# Altium project Mixer_8ch_USB_Jack.PrjPcb
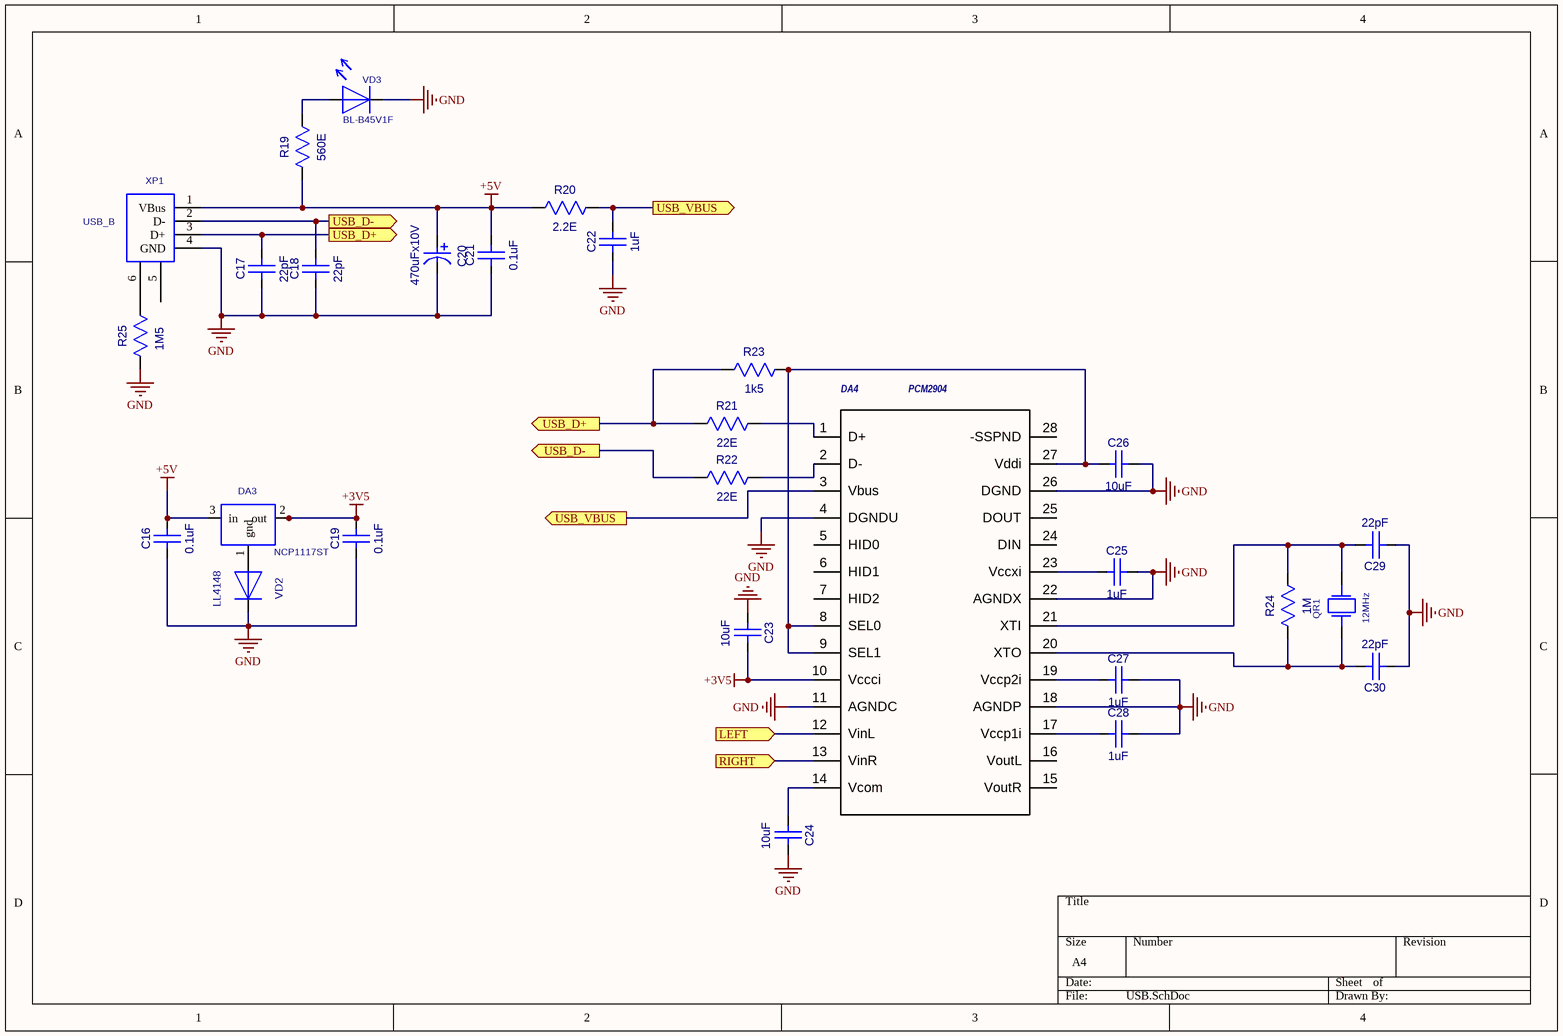
[diagram p0: USB.SchDoc]
2 sheets, 93 parts. Net scope: flat (ports and power ports of the same name join across sheets).
Board file: Mixer_8_USB_jack.PcbDoc
Sheets:
  USB.SchDoc
  Analog_out.SchDoc

## Sheet USB.SchDoc
size A4

### Parts
C16  0.1uF  [CC0603-3M]
C17  22pF  [CC0603-3M]
C18  22pF  [CC0603-3M]
C19  0.1uF  [CC0603-3M]
C20  470uFx10V  [CC8X3.5]
C21  0.1uF  [CC0603-3M]
C22  1uF  [CC0603-3M]
C23  10uF  [CC0805-MIDI-2M1]
C24  10uF  [CC0805-MIDI-2M1]
C25  1uF  [CC0603-3M]
C26  10uF  [CC0805-MIDI-2M1]
C27  1uF  [CC0603-3M]
C28  1uF  [CC0603-3M]
C29  22pF  [CC0603-3M]
C30  22pF  [CC0603-3M]
DA3  NCP1117ST  [SOT-223]
DA4  PCM2904  [TSSOP28]
QR1  12MHz  [HC-49]
R19  560E  [RC0603-3M]
R20  2.2E  [RC0805_IPC_NOM]
R21  22E  [RC0603-3M]
R22  22E  [RC0603-3M]
R23  1k5  [RC0603-3M]
R24  1M  [RC0603-3M]
R25  1M5  [RC1206-2M]
VD2  LL4148  [SOD-80]
VD3  BL-B45V1F  [LED3]
XP1  USB_B  [USB-B]

### Ports
LEFT (in), RIGHT (in), USB_D+ (out), USB_D- (out), USB_VBUS (out)

### Nets
+3V5: C19.2(B) C23.2(B) DA3.2(out) DA3.4 DA4.10(Vccci)
+5V: C16.2(B) C20.1 C21.2(B) DA3.3(in) R19.1(A) R20.1(A) XP1.1(VBus)
GND: C16.1(A) C17.1(A) C18.1(A) C19.1(A) C20.2 C21.1(A) C22.1(A) C23.1(A) C24.2(B) C25.2(B) C26.2(B) C27.2(B) C28.2(B) C29.1(A) C30.1(A) DA4.4(DGNDU) DA4.11(AGNDC) DA4.18(AGNDP) DA4.22(AGNDX) DA4.26(DGND) R25.1(A) VD2.2(+) VD3.1 XP1.4(GND)
NetC14_2: DA4.12(VinL) ; port LEFT
NetC15_2: DA4.13(VinR) ; port RIGHT
NetC17_2: C17.2(B) R21.1(A) R23.1(A) XP1.3(D+) ; port USB_D+
NetC18_2: C18.2(B) R22.1(A) XP1.2(D-) ; port USB_D-
NetC22_2: C22.2(B) DA4.3(Vbus) R20.2(B) ; port USB_VBUS
NetC24_1: C24.1(A) DA4.14(Vcom)
NetC25_1: C25.1(A) DA4.23(Vccxi)
NetC26_1: C26.1(A) DA4.8(SEL0) DA4.9(SEL1) DA4.27(Vddi) R23.2(B)
NetC27_1: C27.1(A) DA4.19(Vccp2i)
NetC28_1: C28.1(A) DA4.17(Vccp1i)
NetC29_2: C29.2(B) DA4.21(XTI) QR1.2 R24.2(B)
NetC30_2: C30.2(B) DA4.20(XTO) QR1.1 R24.1(A)
NetDA3_1: DA3.1(gnd) VD2.1(-)
NetDA4_1: DA4.1(D+) R21.2(B)
NetDA4_2: DA4.2(D-) R22.2(B)
NetR19_2: R19.2(B) VD3.2
NetR25_2: R25.2(B) XP1.6

Not connected (* = marked no-connect by the designer): DA4 5(HID0) 6(HID1) 7(HID2) 15(VoutR) 16(VoutL) 24(DIN) 25(DOUT) 28(-SSPND); XP1 5

### Library data of the parts
C16-C19 C21 C22 C25 C27-C30 = CC0603
  C16 C19 C21: Value: 0.1uF
  C17 C18 C29 C30: Value: 22pF
  C22 C25 C27 C28: Value: 1uF
C20 = CAP0.35: Value: 470uFx10V
C23 C24 C26 = CC0805: Value: 10uF
QR1 = LP-3.5: Value: 12MHz
R19 R21-R24 = RC0603
  R19: Value: 560E
  R21 R22: Value: 22E
  R23: Value: 1k5
  R24: Value: 1M
R20 = RC0805: Value: 2.2E
R25 = RC1206: Value: 1M5
VD3 = LED_3: Value: BL-B45V1F
DA3 = NCP1117ST: Value: *
DA4 = PCM2904: Value: *
VD2 = LL4148: Value: *
XP1 = USB_B: Value: *

## Sheet Analog_out.SchDoc
size A4
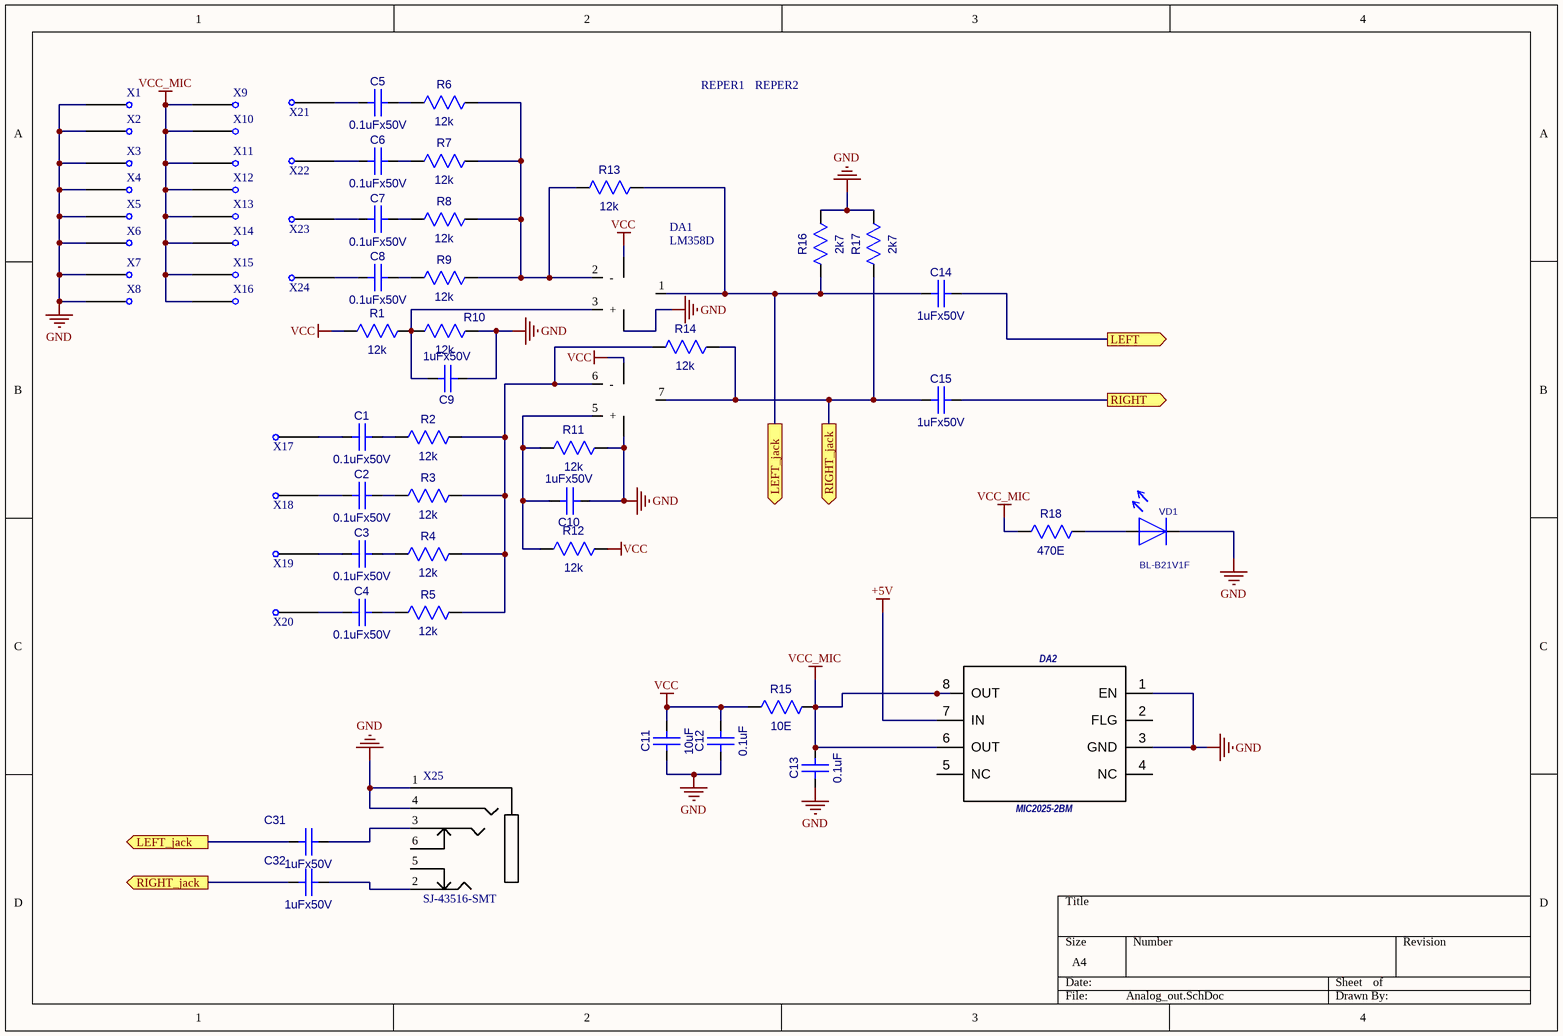
[diagram p1: Analog_out.SchDoc]

### Parts
C1  0.1uFx50V  [CC0603-3M]
C2  0.1uFx50V  [CC0603-3M]
C3  0.1uFx50V  [CC0603-3M]
C4  0.1uFx50V  [CC0603-3M]
C5  0.1uFx50V  [CC0603-3M]
C6  0.1uFx50V  [CC0603-3M]
C7  0.1uFx50V  [CC0603-3M]
C8  0.1uFx50V  [CC0603-3M]
C9  1uFx50V  [CC0603-3M]
C10  1uFx50V  [CC0603-3M]
C11  10uF  [CC0805-MIDI-2M1]
C12  0.1uF  [CC0603-3M]
C13  0.1uF  [CC0603-3M]
C14  1uFx50V  [CC0603-3M]
C15  1uFx50V  [CC0603-3M]
C31  1uFx50V  [CC0603-3M]
C32  1uFx50V  [CC0603-3M]
DA1  LM358D  [SO-8]
DA2  MIC2025-2BM  [SO-8]
R1  12k  [RC0603-3M]
R2  12k  [RC0603-3M]
R3  12k  [RC0603-3M]
R4  12k  [RC0603-3M]
R5  12k  [RC0603-3M]
R6  12k  [RC0603-3M]
R7  12k  [RC0603-3M]
R8  12k  [RC0603-3M]
R9  12k  [RC0603-3M]
R10  12k  [RC0603-3M]
R11  12k  [RC0603-3M]
R12  12k  [RC0603-3M]
R13  12k  [RC0603-3M]
R14  12k  [RC0603-3M]
R15  10E  [RC0805_IPC_NOM]
R16  2k7  [RC0603-3M]
R17  2k7  [RC0603-3M]
R18  470E  [RC0603-3M]
REPER1  REPER1.2  [REPER1.2]  (value not drawn)
REPER2  REPER1.2  [REPER1.2]  (value not drawn)
VD1  BL-B21V1F  [LED3]
X1  PIN_1mm  [PIN_1mm]  (value not drawn)
X2  PIN_1mm  [PIN_1mm]  (value not drawn)
X3  PIN_1mm  [PIN_1mm]  (value not drawn)
X4  PIN_1mm  [PIN_1mm]  (value not drawn)
X5  PIN_1mm  [PIN_1mm]  (value not drawn)
X6  PIN_1mm  [PIN_1mm]  (value not drawn)
X7  PIN_1mm  [PIN_1mm]  (value not drawn)
X8  PIN_1mm  [PIN_1mm]  (value not drawn)
X9  PIN_1mm  [PIN_1mm]  (value not drawn)
X10  PIN_1mm  [PIN_1mm]  (value not drawn)
X11  PIN_1mm  [PIN_1mm]  (value not drawn)
X12  PIN_1mm  [PIN_1mm]  (value not drawn)
X13  PIN_1mm  [PIN_1mm]  (value not drawn)
X14  PIN_1mm  [PIN_1mm]  (value not drawn)
X15  PIN_1mm  [PIN_1mm]  (value not drawn)
X16  PIN_1mm  [PIN_1mm]  (value not drawn)
X17  PIN_1mm  [PIN_1mm]  (value not drawn)
X18  PIN_1mm  [PIN_1mm]  (value not drawn)
X19  PIN_1mm  [PIN_1mm]  (value not drawn)
X20  PIN_1mm  [PIN_1mm]  (value not drawn)
X21  PIN_1mm  [PIN_1mm]  (value not drawn)
X22  PIN_1mm  [PIN_1mm]  (value not drawn)
X23  PIN_1mm  [PIN_1mm]  (value not drawn)
X24  PIN_1mm  [PIN_1mm]  (value not drawn)
X25  SJ-43516-SMT  [SJ-43516-SMT]

### Ports
LEFT (out), LEFT_jack (out), RIGHT (out), RIGHT_jack (out)

### Nets
+5V: DA2.7(IN)
GND: C9.1(A) C10.1(A) C11.1(A) C12.1(A) C13.1(A) DA1.4(Vss) DA2.1(EN) DA2.3(GND) R10.2(B) R11.2(B) R16.2(B) R17.2(B) VD1.1 X1.1 X2.1 X3.1 X4.1 X5.1 X6.1 X7.1 X8.1 X25.1 X25.4
VCC: C11.2(B) C12.2(B) DA1.8(Vdd) R1.1(A) R12.2(B) R15.1(A)
VCC_MIC: C13.2(B) DA2.6(OUT) DA2.8(OUT) R15.2(B) R18.1(A) X9.1 X10.1 X11.1 X12.1 X13.1 X14.1 X15.1 X16.1
NetC1_1: C1.1(A) X17.1
NetC1_2: C1.2(B) R2.1(A)
NetC2_1: C2.1(A) X18.1
NetC2_2: C2.2(B) R3.1(A)
NetC3_1: C3.1(A) X19.1
NetC3_2: C3.2(B) R4.1(A)
NetC4_1: C4.1(A) X20.1
NetC4_2: C4.2(B) R5.1(A)
NetC5_1: C5.1(A) X21.1
NetC5_2: C5.2(B) R6.1(A)
NetC6_1: C6.1(A) X22.1
NetC6_2: C6.2(B) R7.1(A)
NetC7_1: C7.1(A) X23.1
NetC7_2: C7.2(B) R8.1(A)
NetC8_1: C8.1(A) X24.1
NetC8_2: C8.2(B) R9.1(A)
NetC9_2: C9.2(B) DA1.3(+) R1.2(B) R10.1(A)
NetC10_2: C10.2(B) DA1.5(+) R11.1(A) R12.1(A)
NetC14_1: C14.1(A) C31.1(A) DA1.1(Out1) R13.2(B) R16.1(A) ; port LEFT_jack
NetC14_2: C14.2(B) ; port LEFT
NetC15_1: C15.1(A) C32.1(A) DA1.7(Out2) R14.2(B) R17.1(A) ; port RIGHT_jack
NetC15_2: C15.2(B) ; port RIGHT
NetC31_2: C31.2(B) X25.3
NetC32_2: C32.2(B) X25.2
NetDA1_2: DA1.2(-) R6.2(B) R7.2(B) R8.2(B) R9.2(B) R13.1(A)
NetDA1_6: DA1.6(-) R2.2(B) R3.2(B) R4.2(B) R5.2(B) R14.1(A)
NetR18_2: R18.2(B) VD1.2

Not connected (* = marked no-connect by the designer): DA2 2(FLG) 4(NC) 5(NC); REPER1 1; REPER2 1; X25 5 6

### Library data of the parts
C1-C10 C14 C15 C31 C32 = CC0603: CC0603 X7R
  C1-C8: Value: 0.1uFx50V
  C9 C10 C14 C15 C31 C32: Value: 1uFx50V
C11 = CC0805: Value: 10uF
C12 C13 = CC0603: Value: 0.1uF
R1-R14 R16-R18 = RC0603
  R1-R14: Value: 12k
  R16 R17: Value: 2k7
  R18: Value: 470E
R15 = RC0805: Value: 10E
VD1 = LED_3: Value: BL-B21V1F
X25 = SJ-43516-SMT: 3.5mm connector 4 conductors
DA1 = LM358D: Value: LM358D
DA2 = MIC2025-2BM: Value: *
REPER1 REPER2 = REPER1.2: Value: *

## Nets that join several sheets
+5V: USB (7 pins), Analog_out (DA2.7)
GND: USB (24 pins), Analog_out (23 pins)
NetC14_2: USB (DA4.12), Analog_out (C14.2)
NetC15_2: USB (DA4.13), Analog_out (C15.2)